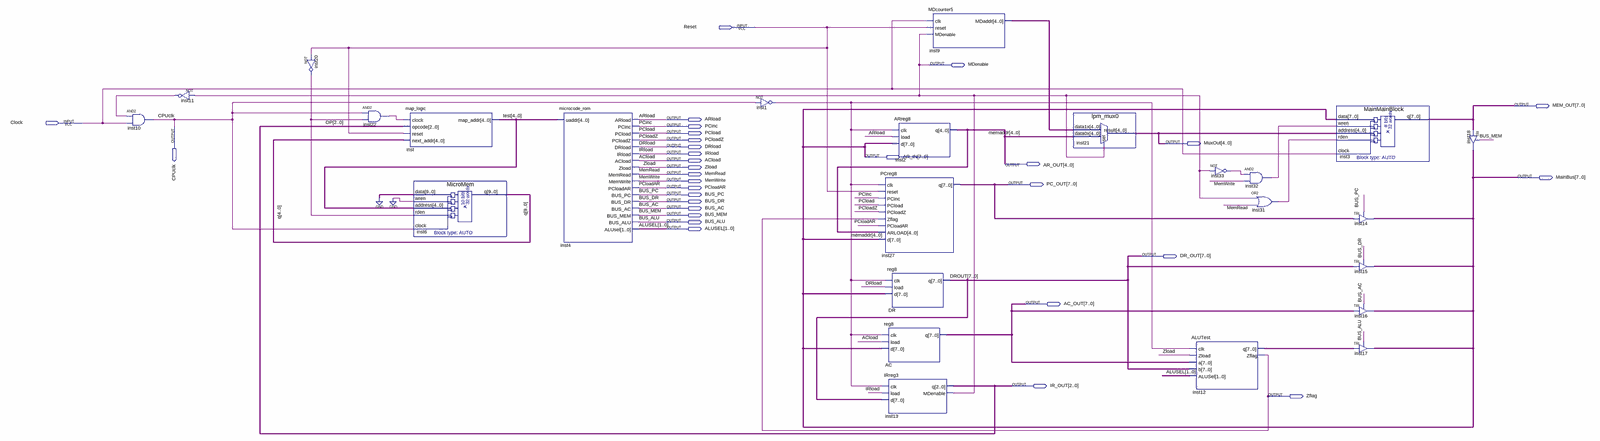
[diagram p0: schematic sheet, whole]
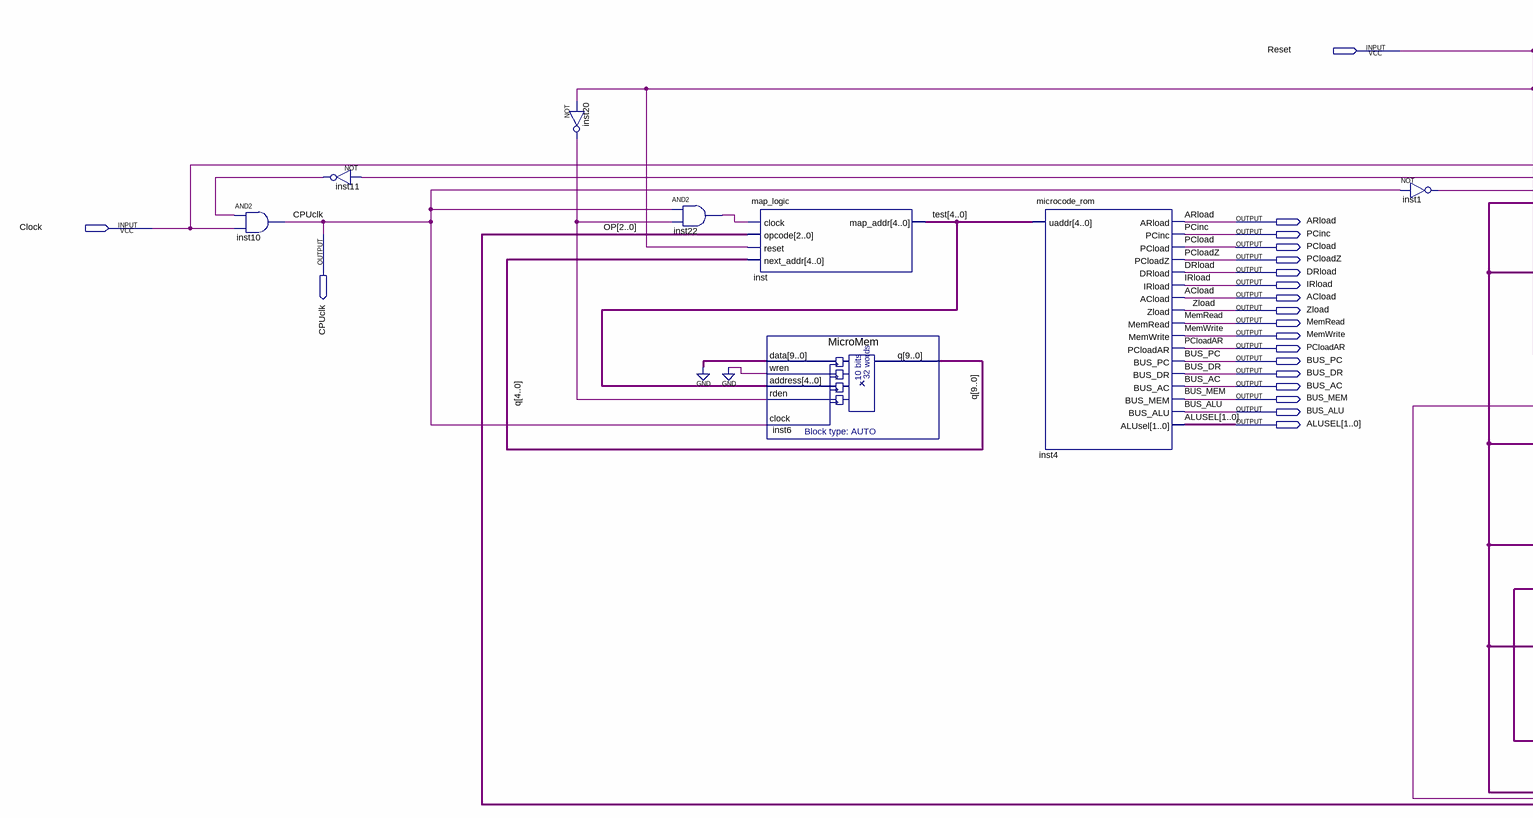
[diagram p1: schematic sheet, left part]
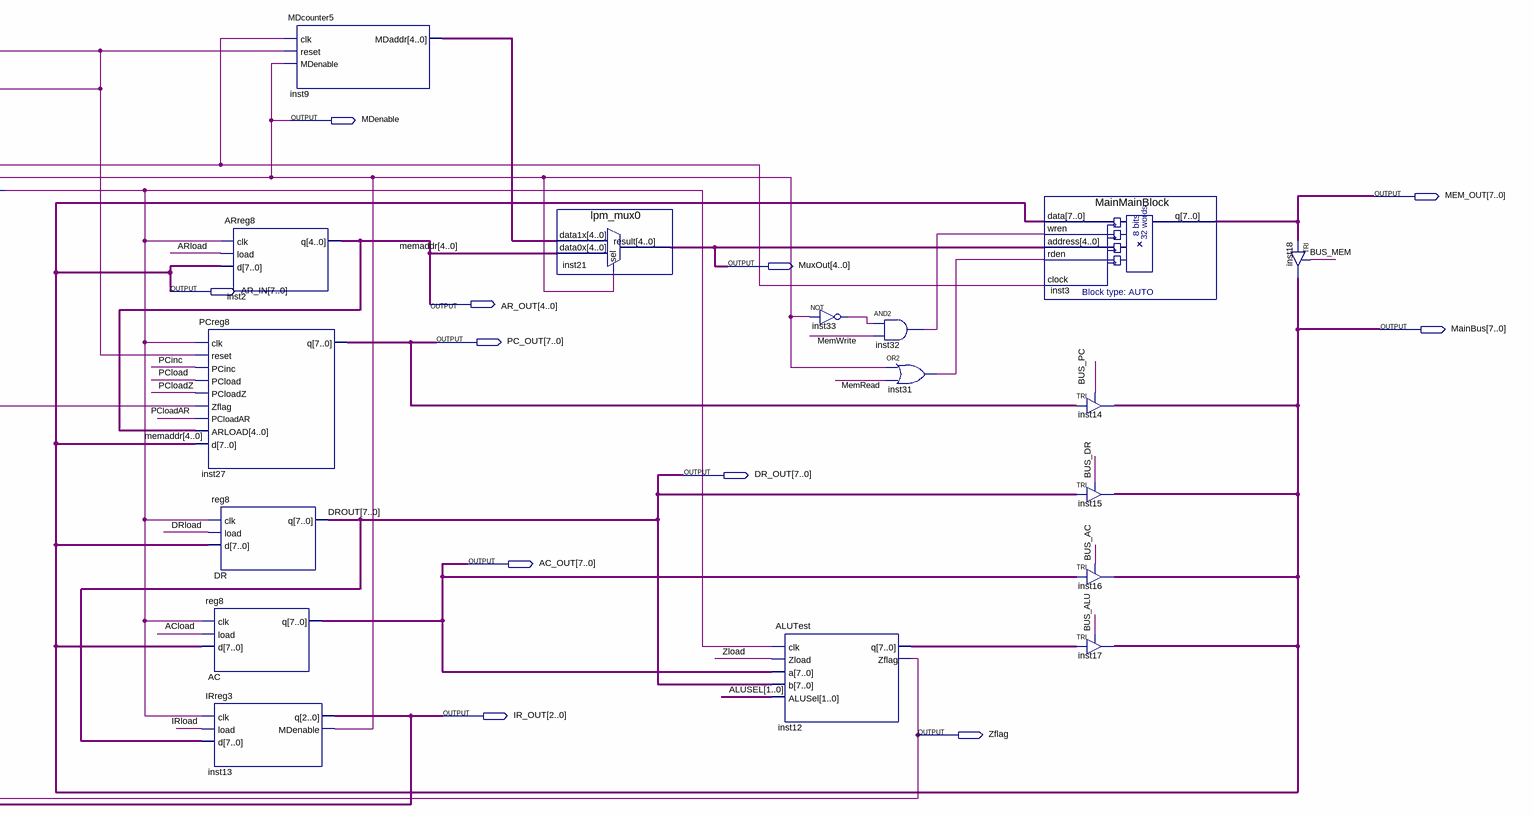
[diagram p2: schematic sheet, right part]
// Quartus schematic CE4720_SimpleCPU.bdf as structural Verilog: 25 symbols, 31 pins
module CE4720_SimpleCPU (
  input  Reset,
  input  Clock,
  output MDenable,
  output [7:0] MEM_OUT,
  output ARload,
  output CPUclk,
  output PCinc,
  output PCload,
  output PCloadZ,
  output [4:0] MuxOut,
  output DRload,
  output IRload,
  output [7:0] AR_IN,
  output ACload,
  output [4:0] AR_OUT,
  output Zload,
  output MemRead,
  output [7:0] MainBus,
  output MemWrite,
  output [7:0] PC_OUT,
  output PCloadAR,
  output BUS_PC,
  output BUS_DR,
  output BUS_AC,
  output BUS_MEM,
  output BUS_ALU,
  output [1:0] ALUSEL,
  output [7:0] DR_OUT,
  output [7:0] AC_OUT,
  output [2:0] IR_OUT,
  output Zflag
);

  wire inst1_out, inst11_out, inst20_out, inst22_out, inst31_out, inst32_out, inst33_out;
  wire [4:0] inst9_mdaddr, test;
  wire [7:0] inst12_q;
  wire [9:0] q;

  and inst10 (CPUclk, inst11_out, Clock);
  not inst11 (inst11_out, MDenable);
  not inst20 (inst20_out, Reset);
  and inst22 (inst22_out, CPUclk, inst20_out);
  map_logic inst (.clock(inst22_out), .opcode(IR_OUT), .reset(Reset), .next_addr(q[4:0]), .map_addr(test));
  MicroMem inst6 (.data({10{1'b0}}), .wren(1'b0), .address(test), .rden(inst20_out), .clock(CPUclk), .q(q));
  microcode_rom inst4 (
    .uaddr(test), .ARload(ARload), .PCinc(PCinc), .PCload(PCload), .PCloadZ(PCloadZ), .DRload(DRload),
    .IRload(IRload), .ACload(ACload), .Zload(Zload), .MemRead(MemRead), .MemWrite(MemWrite),
    .PCloadAR(PCloadAR), .BUS_PC(BUS_PC), .BUS_DR(BUS_DR), .BUS_AC(BUS_AC), .BUS_MEM(BUS_MEM),
    .BUS_ALU(BUS_ALU), .ALUsel(ALUSEL));
  not inst1 (inst1_out, CPUclk);
  PCreg8 inst27 (
    .clk(inst1_out), .reset(Reset), .PCinc(PCinc), .PCload(PCload), .PCloadZ(PCloadZ), .Zflag(Zflag),
    .PCloadAR(PCloadAR), .ARLOAD(AR_OUT), .d(AR_IN), .q(PC_OUT));
  reg8 DR (.clk(inst1_out), .load(DRload), .d(AR_IN), .q(DR_OUT));
  reg8 AC (.clk(inst1_out), .load(ACload), .d(AR_IN), .q(AC_OUT));
  IRreg3 inst13 (.clk(inst1_out), .load(IRload), .d(DR_OUT), .q(IR_OUT), .MDenable(MDenable));
  ARreg8 inst2 (.clk(inst1_out), .load(ARload), .d(AR_IN), .q(AR_OUT));
  MDcounter5 inst9 (.clk(Clock), .reset(Reset), .MDenable(MDenable), .MDaddr(inst9_mdaddr));
  lpm_mux0 inst21 (.data1x(inst9_mdaddr), .data0x(AR_OUT), .sel(MDenable), .result(MuxOut));
  ALUTest inst12 (.clk(inst1_out), .Zload(Zload), .a(AC_OUT), .b(DR_OUT), .ALUSel(ALUSEL), .q(inst12_q), .Zflag(Zflag));
  not inst33 (inst33_out, MDenable);
  and inst32 (inst32_out, inst33_out, MemWrite);
  or inst31 (inst31_out, MDenable, MemRead);
  MainMainBlock inst3 (
    .data(AR_IN), .wren(inst32_out), .address(MuxOut), .rden(inst31_out), .clock(Clock), .q(MEM_OUT));
  TRI inst14[7:0] (.IN(PC_OUT), .OE(BUS_PC), .OUT(AR_IN));
  TRI inst15[7:0] (.IN(DR_OUT), .OE(BUS_DR), .OUT(AR_IN));
  TRI inst16[7:0] (.IN(AC_OUT), .OE(BUS_AC), .OUT(AR_IN));
  TRI inst17[7:0] (.IN(inst12_q), .OE(BUS_ALU), .OUT(AR_IN));
  TRI inst18[7:0] (.IN(MEM_OUT), .OE(BUS_MEM), .OUT(AR_IN));

  assign MainBus = AR_IN;

  // Other names for the same wires on the sheet: DROUT[7:0] = DR_OUT; memaddr[4:0] = AR_OUT; OP[2:0] = IR_OUT
endmodule
